# Altium schematic sheet motordriver-v4.0_power-stage.SchDoc
size A4; SheetNumber: 1; SheetTotal: 1
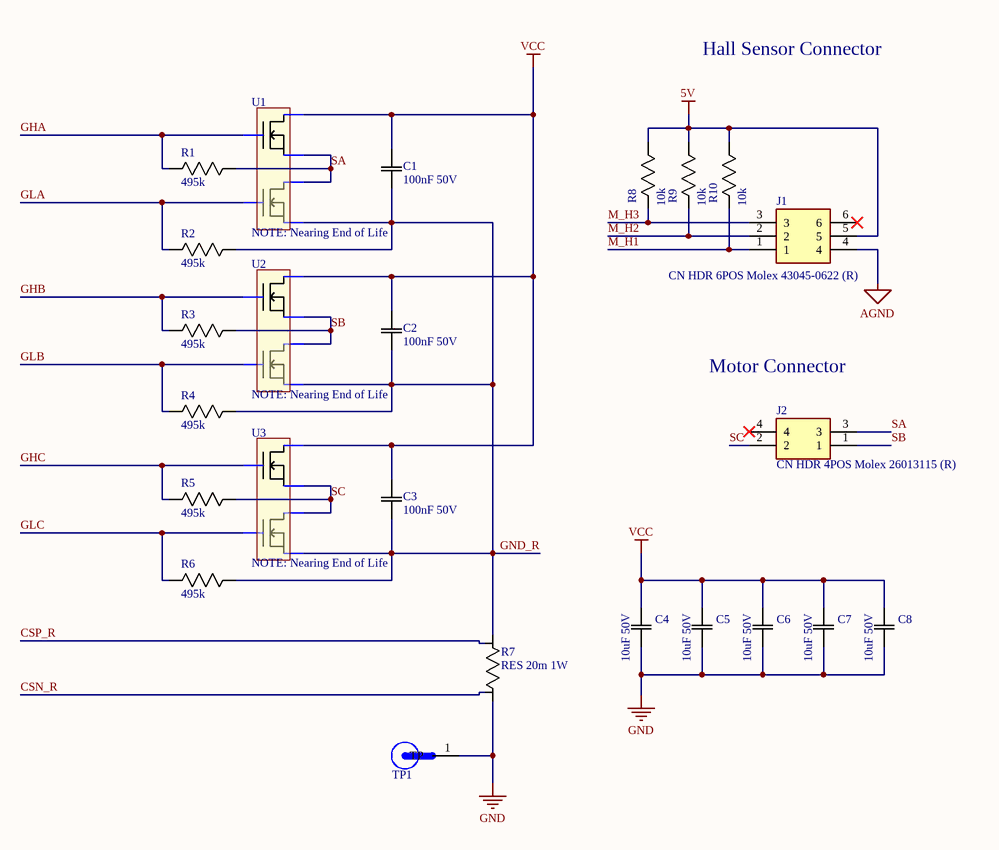
[diagram p0: motordriver-v4.0_power-stage.SchDoc]

## Parts
C1  100nF 50V  [0603]
C2  100nF 50V  [0603]
C3  100nF 50V  [0603]
C4  10uF 50V  [0805]
C5  10uF 50V  [0805]
C6  10uF 50V  [0805]
C7  10uF 50V  [0805]
C8  10uF 50V  [0805]
J1  CN HDR 6POS Molex 43045-0622 (R)  [430450622]
J2  CN HDR 4POS Molex 26013115 (R)  [26013115]
R1  495k  [0603]
R2  495k  [0603]
R3  495k  [0603]
R4  495k  [0603]
R5  495k  [0603]
R6  495k  [0603]
R7  RES 20m 1W  [1206 - Sense]
R8  10k  [0603]
R9  10k  [0603]
R10  10k  [0603]
TP1  Test Point - 5019  [TP380X203]  (value not drawn)
U1  NOTE: Nearing End of Life  [PG-TDSON-8-10]
U2  NOTE: Nearing End of Life  [PG-TDSON-8-10]
U3  NOTE: Nearing End of Life  [PG-TDSON-8-10]

## Nets
5V: J1.5 R8.1(R1) R9.1(R1) R10.1(R1)
AGND: J1.4
GND: C4.2(C2) C5.2(C2) C6.2(C2) C7.2(C2) C8.2(C2) R7.2(R2) TP1.1(TP)
VCC: C1.2(C2) C2.2(C2) C3.2(C2) C4.1(C1) C5.1(C1) C6.1(C1) C7.1(C1) C8.1(C1) U1.8(D1) U2.8(D1) U3.8(D1)
CSN_R: R7.4
CSP_R: R7.3
GHA: R1.2(R2) U1.2(G1)
GHB: R3.2(R2) U2.2(G1)
GHC: R5.2(R2) U3.2(G1)
GLA: R2.2(R2) U1.4(G2)
GLB: R4.2(R2) U2.4(G2)
GLC: R6.2(R2) U3.4(G2)
GND_R: C1.1(C1) C2.1(C1) C3.1(C1) R2.1(R1) R4.1(R1) R6.1(R1) R7.1(R1) U1.3(S2) U2.3(S2) U3.3(S2)
M_H1: J1.1 R10.2(R2)
M_H2: J1.2 R9.2(R2)
M_H3: J1.3 R8.2(R2)
SA: J2.3 R1.1(R1) U1.1(S1) U1.6(D2)
SB: J2.1 R3.1(R1) U2.1(S1) U2.6(D2)
SC: J2.2 R5.1(R1) U3.1(S1) U3.6(D2)

Not connected (* = marked no-connect by the designer): J1 6*; J2 4*

## Notes on the sheet
- Hall Sensor Connector
- Motor Connector

## Library data of the parts
C1-C3 = CAP 100nF 50V: CAP CER 0.1UF 50V X7R 0805; Tolerance: 10%; Package: 0805; Value: 100nF; Rating: 50V
C4-C8 = CAP 10uF 50V: CAP CER 10UF 50V X7R; Tolerance: 10%; Package: 1210; Value: 10uF; Rating: 50V; ComponentLink1Description: digikey; ComponentLink1URL: https://www.digikey.ca/en/products/detail/kemet/C1210C106M5RACTU/4918883
J1 = CN HDR 6POS Molex 43045-0622 (R): Molex 43045-0622 6POS Microfit / dual row, right angle
J2 = CN HDR 4POS Molex 26013115 (R): Molex 26013115 4POS Minifit / dual row, right angle
R1-R6 = RES 495k 1/8W: RES SMD 499K OHM 1% 1/8W 0805; Manufacturer: Yageo; Manufacturer Part Number: RC0805FR-07499KL; Temperature Coefficient: 100ppm/°C; Voltage Rating (DC): 150V; Resistance: 499kR; Power Rating: 125mW; Supplier 1: Digi-Key; RoHS: Yes; Category: Chip SMD Resistors; Stock 1: 2275; Pricing 1: 1=0.10000, 10=0.04000, 100=0.01630, 1000=0.00731, 2500=0.00635 (USD); Case/Package: 0805; Case Code (Metric): 2012; Case Code (Imperial): 0805; Contact Plating: Tin,Lead,Matte; Min Operating Temperature: -55°C; Max Operating Temperature: 155°C; Termination: SMD/SMT; Composition: Thick Film; Military Standard: Not; Tolerance: 1%; Voltage Rating: 150V; Packaging: Tape and Reel; Length: 2mm; Depth: 1.25mm; Radiation Hardening: No; Lead Free: Lead Free; ComponentLink1URL: https://datasheet.ciiva.com/15189/getdatasheetpartid-326570-15189975.pdf?src-supplier=Verical; ComponentLink1Description: https://datasheet.ciiva.com/15189/getdatasheetpartid-326570-15189975.pdf?src-supplier=Verical; Supplier Part Number 1: 311-499KCRCT-ND
R7 = RES 20m 1W: RES SMD 0.02 OHM 1% 1W 1206
R8-R10 = RES 10k 1/8W - 1%: RES SMD 10K OHM 1% 1/8W 0805; Power (Watts): 0.125W; Package: 0805; Value: 10k; Tolerance: 1%
TP1 = Test Point - 5019: PC Test Point, Miniature Phosphor Bronze, Silver Plating Surface Mount Mounting Type; MP: 5019; MF: Keystone Electronics; Value: *; Package: 2010 Keystone; Digi-Key_Part_Number: 36-5019CT-ND; Digi-Key_Purchase_URL: https://www.digikey.com/product-detail/en/keystone-electronics/5019/36-5019CT-ND/3907344?utm_source=snapeda&utm_medium=aggregator&utm_campaign=symbol
U1-U3 = MOSFET IPG20N06S4-15A: MOSFET N+N 60V 20A; MF: Infineon Technologies; MF P/N: IPG20N06S4-15A; Supplier 1: Mouser; Supplier Part Number 1: 726-IPG20N06S415ATMA